# EasyEDA schematic OnlineCODetector_TGS5042_v2_2026-06-24.json
TITLE: Sheet_1; REV: 1.0; Date: 2025-08-12; Sheet: 1/1; Drawn By: Mirzohid; Company: Your Company
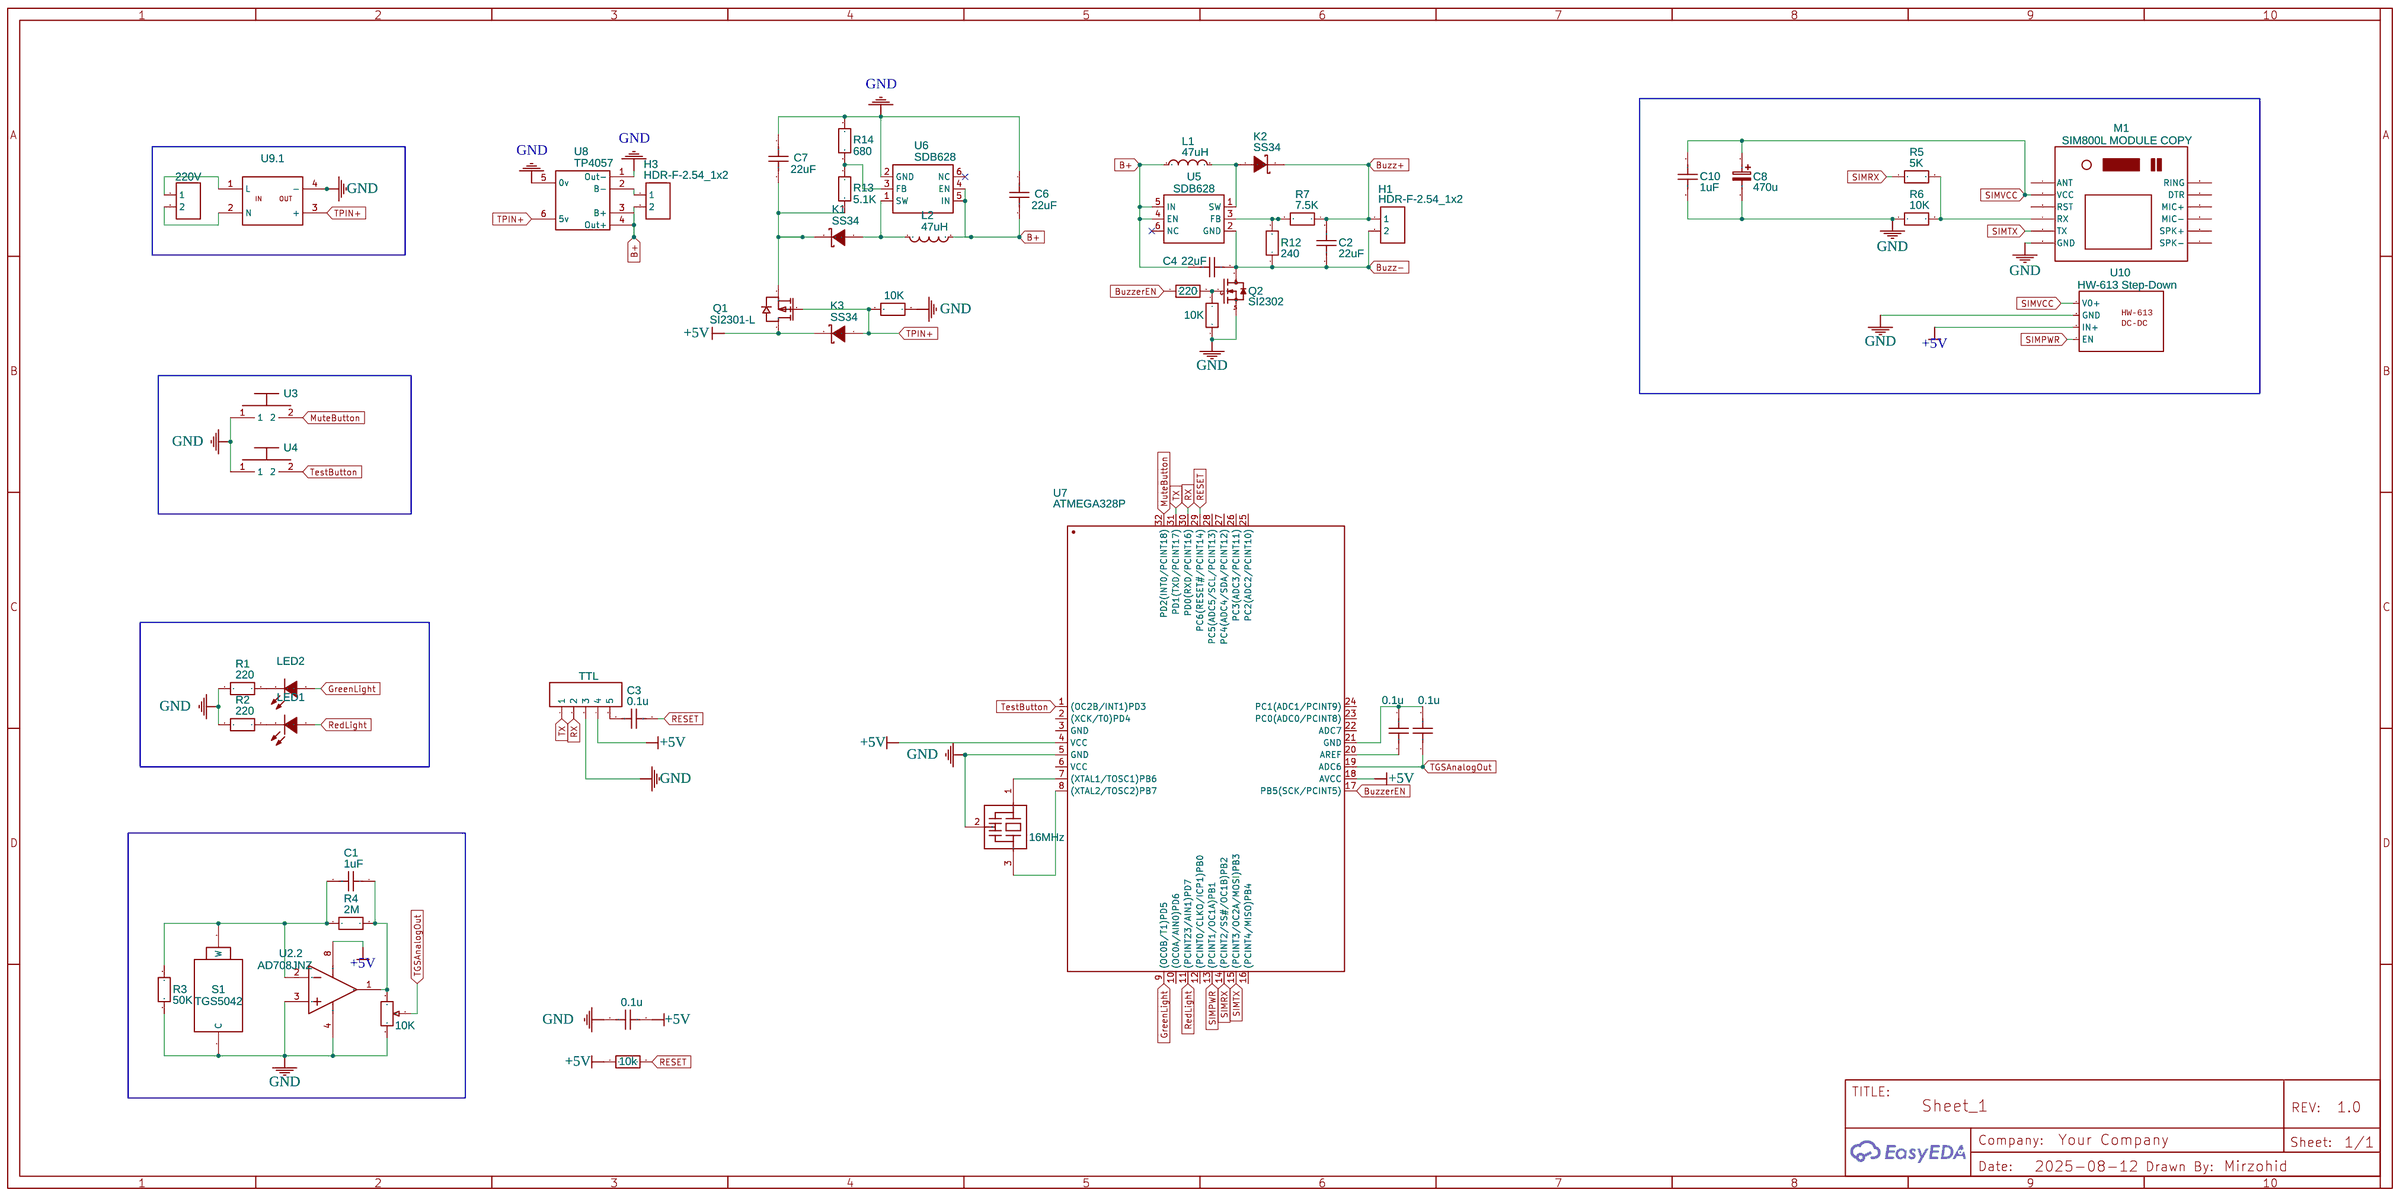
[diagram p0: schematic sheet]

## Parts
10K  R_3296W_EU  [RES-ADJ-TH_3296W]
220V  CONN-TH_2P-P5.00  [CONN-TH_2P-P5.00]
C1  1uF  [C0603]
C2  22uF  [C0805]
C3  0.1u  [C0805]
C4  22uF  [C0805]
C5  0.1u  [C0805]
C6  22uF  [C0805]
C7  22uF  [C0805]
C8  470u  [CAP-D6.3-F2.5]
C9  0.1u  [C0805]
C10  1uF  [C0805]
C11  0.1u  [C0805]
H1  HDR-F-2.54_1x2  [HDR-F-2.54_1X2]
H3  HDR-F-2.54_1x2  [HDR-F-2.54_1X2]
K1  SS34  [SS34-SMD]
K2  SS34  [SS34-SMD]
K3  SS34  [SS34-SMD]
L1  47uH  [L1812]
L2  47uH  [L1812]
LED1  LED-0603_R  [LED-TH_BD4.3-P2.54]
LED2  LED-0603_G  [LED-TH_BD4.3-P2.54]
M1  SIM800L MODULE COPY  [SIM800L]
Q1  SI2301-L  [SOT-23-3_L2.9-W1.6-P1.90-LS2.8-BR]
Q2  SI2302  [SOT-23-3_L2.9-W1.3-P1.90-LS2.4-BR]
R1  220  [R0805]
R2  220  [R0805]
R3  50K  [R0805]
R4  2M  [R0805]
R5  5K  [R0805]
R6  10K  [R0805]
R7  7.5K  [R0805]
R8  220  [R0805]
R9  10K  [R0805]
R10  10K  [R0805]
R12  240  [R0805]
R13  5.1K  [R0805]
R14  680  [R0805]
R15  10k  [R0805]
S1  TGS5042  [TGS5042]
TTL  HDR-F-2.54_1x5  [HDR-F-2.54_1X5]
U2  AD708JNZ  [DIP8]  (section 2)
U3  SmallDIPButton  [КРАСНАЯ ШАПОЧКА]
U4  SmallDIPButton  [КРАСНАЯ ШАПОЧКА]
U5  SDB628  [SB6286]
U6  SDB628  [SB6286]
U7  ATMEGA328P  [LQFP-32_L7.0-W7.0-P0.80-LS9.0-TL]
U8  TP4057  [CHARGING MODULE TP4057 MINI]
U9  AC220V-DC5V-700MA REV1  [AC220V-DC5V-700MA]  (section 1)
U10  HW-613 Step-Down  [HW-613]
X1  16MHz  [OSC-SMD_3P-L3.2-W1.3-P1.2-L]

## Library data of the parts
10K = R_3296W_EU: Supplier: LCSC; Contributor: LCEDA_Lib; Value(Ω): 10k
220V = CONN-TH_2P-P5.00: Supplier: LCSC; Contributor: LCEDA_Lib; Package Display: No
C1 C10 = C_RAD-0.2_US: Contributor: LCEDA_Lib
C2 C4 C6 C7 = C_0402_US: Contributor: LCEDA_Lib
C3 = C_0805_US: Contributor: LCEDA_Lib
C5 C9 C11 = C_0603_US: Contributor: LCEDA_Lib
C8 = CE_TH_D5.0×F2.0_EU: Contributor: LCEDA_Lib
H1 H3 = HDR-F-2.54_1x2: Supplier Part: C49661; Supplier: LCSC; Contributor: LCEDA_Lib
K1-K3 = SS34: Supplier: LCSC; Supplier Part: C478723; Contributor: anjuakhu16142000; Convert to PCB: Yes; Add into BOM: Yes
L1 L2 = ZENR5040T4R7M-4.7UH: Supplier: LCSC; Supplier Part: C42428064; Manufacturer: ZE(增益); Manufacturer Part: ZENR5040T4R7M-4.7uH; Contributor: lcsc
LED1 = LED-0603_R: Manufacturer: EVERLIGHT(台湾亿光); Manufacturer Part: 19-217/R6C-AL1M2VY/3T; Supplier Part: C72044; Supplier: LCSC; Contributor: LCEDA_01
LED2 = LED-0603_G: Manufacturer: EVERLIGHT(台湾亿光); Manufacturer Part: 19-217/GHC-YR1S2/3T; Supplier Part: C72043; Supplier: LCSC; Contributor: LCEDA_Lib
M1 = SIM800L MODULE COPY: Contributor: mateus88
Q1 = SI2301-L: Supplier: LCSC; Supplier Part: C41376470; Manufacturer: PIELENST(派量); Contributor: lcsc; JLCPCB Part Class: Extended Part
Q2 = SI2302: Contributor: LCSC; Supplier: LCSC; Manufacturer: Hottech(合科泰); Supplier Part: C181087; JLCPCB Part Class: Extended Part
R1-R6 R9 = R_AXIAL-0.3_EU: Contributor: LCEDA_Lib
R7 R12-R14 = R_0201_EU: Contributor: LCEDA_Lib
R8 R10 = R_0805_EU: Contributor: LCEDA_Lib
R15 = R_0603_EU: Contributor: LCEDA_Lib
S1 = TGS5042: Manufacturer Part: Figaro; Contributor: michalklis
TTL = HDR-F-2.54_1x5: Supplier Part: C50950; Supplier: LCSC; Contributor: LCEDA_Lib
U2 = AD708JNZ: Double Channel Very High DC Precision Operational Amplifier, 900KHz BW, 300 mVus SR, Commercial, 8-pin DIP (N-8), Tube; subpart_no: 2
U3 U4 = SmallDIPButton: Contributor: mirzohid
U5 U6 = SDB628: Supplier: LCSC; Manufacturer: SHOUDING; Supplier Part: C77805; JLCPCB Part Class: Extended Part; Contributor: Cyril Pavlovič; Package Display: No
U7 = ATMEGA328P: Contributor: LCSC; Supplier: LCSC; Supplier Part: C9900009806; Manufacturer: null; Manufacturer Part: ATmega328P; JLCPCB Part Class: Extended Part
U8 = Charging Module TP4057 Mini extended: Contributor: diego99calderon; Supplier Part: C440390; Manufacturer: TPOWER(天源); Manufacturer Part: TP4057 (TP4056); JLCPCB Part Class: Extended Part
U9 = AC220V-DC5V-700MA REV1: Supplier: AliExpress; Contributor: rs08; subpart_no: 1
U10 = HW-613 Step-Down: Contributor: andy-thx
X1 = CSTCE16M0V53Z-R0: Supplier: LCSC; Manufacturer: muRata(村田); Supplier Part: C91585; JLCPCB Part Class: Extended Part

## Nets
+5V: C5.2 K3.2(K) Q1.3(D) R15.1 TTL.4 U2.8(+VS) U7.4(VCC) U7.18(AVCC) U10.3(IN+)
GND: 10K.3 C5.1 C6.1 C7.1 C8.2 C10.2 M1.6(GND) Q2.2(S) R1.1 R2.1 R3.1 R6.1 R9.2 R10.2 R14.1 S1.1(C) TTL.3 U2.3(+IN A) U2.4(-VS) U3.1 U4.1 U6.2(GND) U7.5(GND) U8.1(Out-) U8.5(0v) U9.4(-) U10.2(GND) X1.2(VSS)
B+: C4.2 C6.2 H3.2 L1.2 L2.2 U5.4(EN) U5.5(IN) U6.4(EN) U6.5(IN) U8.3(B+) U8.4(Out+)
Buzz+: C2.2 H1.1 K2.2(K) R7.1
Buzz-: C2.1 C4.1 H1.2 Q2.3(D) R12.1 U5.2(GND)
BuzzerEN: R8.1 U7.17(PB5(SCK/PCINT5))
GreenLight: LED2.1 U7.9((OC0B/T1)PD5)
MuteButton: U3.2 U7.32(PD2(INT0/PCINT18))
RedLight: LED1.1 U7.11((PCINT23/AIN1)PD7)
RESET: C3.2 R15.2 U7.29(PC6(RESET#/PCINT14))
RX: TTL.2 U7.30(PD0(RXD/PCINT16))
SIMPWR: U7.13((PCINT1/OC1A)PB1) U10.4(EN)
SIMRX: R5.1 U7.14((PCINT2/SS#/OC1B)PB2)
SIMTX: M1.5(TX) U7.15((PCINT3/OC2A/MOSI)PB3)
SIMVCC: C8.1 C10.1 M1.2(VCC) U10.1(V0+)
TestButton: U4.2 U7.1((OC2B/INT1)PD3)
TGSAnalogOut: 10K.2 C11.1 U7.19(ADC6)
TPIN+: K3.1(A) Q1.1(G) R9.1 U8.6(5v) U9.3(+)
TX: TTL.1 U7.31(PD1(TXD/PCINT17))
Net-(10K-1): 10K.1 C1.1 R4.2 U2.1(OUT A)
Net-(220V-1): 220V.1 U9.1(L)
Net-(220V-2): 220V.2 U9.2(N)
Net-(C1-2): C1.2 R3.2 R4.1 S1.2(W) U2.2(-IN A)
Net-(C3-1): C3.1 TTL.5
Net-(C7-2): C7.2 K1.2(K) Q1.2(S) R13.2
Net-(C9-1): C9.1 U7.20(AREF)
Net-(C9-2): C9.2 C11.2 U7.21(GND)
Net-(H3-1): H3.1 U8.2(B-)
Net-(K1-1): K1.1(A) L2.1 U6.1(SW)
Net-(K2-1): K2.1(A) L1.1 U5.1(SW)
Net-(LED1-2): LED1.2 R2.2
Net-(LED2-2): LED2.2 R1.2
Net-(M1-4): M1.4(RX) R5.2 R6.2
Net-(Q2-1): Q2.1(G) R8.2 R10.1
Net-(R7-2): R7.2 R12.2 U5.3(FB)
Net-(R13-1): R13.1 R14.2 U6.3(FB)
Net-(U7-7): U7.7((XTAL1/TOSC1)PB6) X1.1
Net-(U7-8): U7.8((XTAL2/TOSC2)PB7) X1.3

Not connected (* = marked no-connect by the designer): M1 1(ANT) 3(RST) 7(SPK-) 8(SPK+) 9(MIC-) 10(MIC+) 11(DTR) 12(RING); U5 6(NC)*; U6 6(NC)*; U7 2((XCK/T0)PD4) 3(GND) 6(VCC) 10((OC0A/AIN0)PD6) 12((PCINT0/CLKO/ICP1)PB0) 16((PCINT4/MISO)PB4) 22(ADC7) 23(PC0(ADC0/PCINT8)) 24(PC1(ADC1/PCINT9)) 25(PC2(ADC2/PCINT10)) 26(PC3(ADC3/PCINT11)) 27(PC4(ADC4/SDA/PCINT12)) 28(PC5(ADC5/SCL/PCINT13))
